# Altium project Version1.PrjPcb
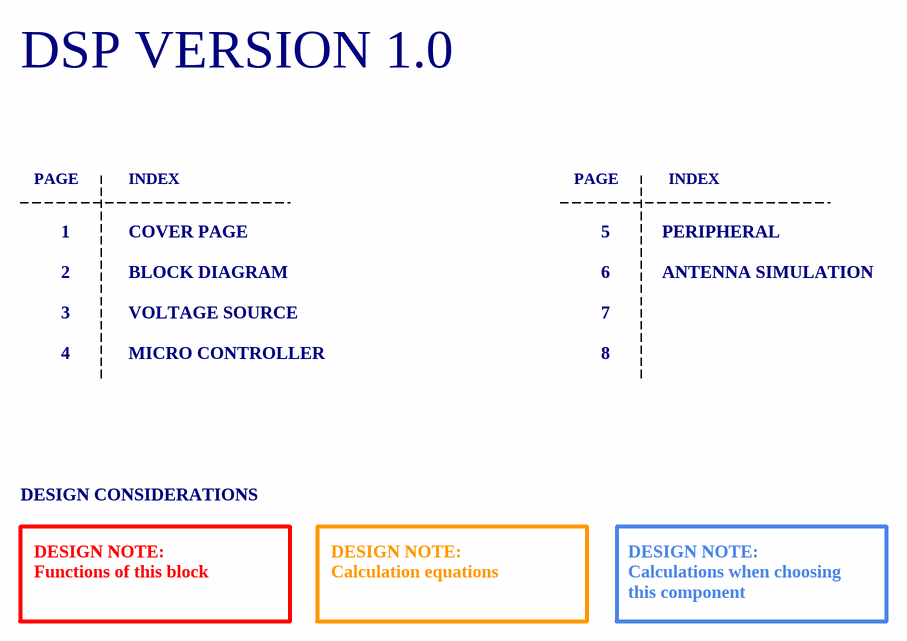
[diagram p0: Cover Page.SchDoc]
6 sheets, 105 parts. Net scope: global (net labels, ports and power ports of the same name join across sheets).
Board file: Version1.PcbDoc
Sheets:
  Cover Page.SchDoc
  Block Diagram.SchDoc
  Voltage Source.SchDoc
  Micro Controller.SchDoc
  Peripheral.SchDoc
  Simulation Antenna.SchDoc

## Sheet Cover Page.SchDoc: Cover Page
size A4; Author: DO DANH LUONG; Revision: 1.0; SheetNumber: 1; SheetTotal: 6; ProjectTitle: DSP_VERSION_1.0

### Notes on the sheet
- DSP VERSION 1.0
- PAGE
- 1
- INDEX
- COVER PAGE
- 5
- PERIPHERAL
- 2
- BLOCK DIAGRAM
- 6
- ANTENNA SIMULATION
- 3
- 4
- VOLTAGE SOURCE
- MICRO CONTROLLER
- 7
- 8
- DESIGN CONSIDERATIONS
- DESIGN NOTE:
  Functions of this block
- DESIGN NOTE:
  Calculation equations
- DESIGN NOTE:
  Calculations when choosing this component
- Author:
- Title:
- Size:
- A4
- Project:
- Approved:
- Revision:
- Modified Date:
- CONFIDENTIAL
- Date:
- SW Version:

## Sheet Block Diagram.SchDoc: Block Diagram
size A4; Author: DO DANH LUONG; Revision: 1.0; SheetNumber: 2; SheetTotal: 6; ProjectTitle: DSP_VERSION_1.0

### Notes on the sheet
- Author:
- Title:
- Size:
- A4
- Project:
- Approved:
- Revision:
- Modified Date:
- CONFIDENTIAL
- Date:
- SW Version:

## Sheet Voltage Source.SchDoc: Voltage Source
size A4; Author: DO DANH LUONG; Revision: 1.0; SheetNumber: 3; SheetTotal: 6
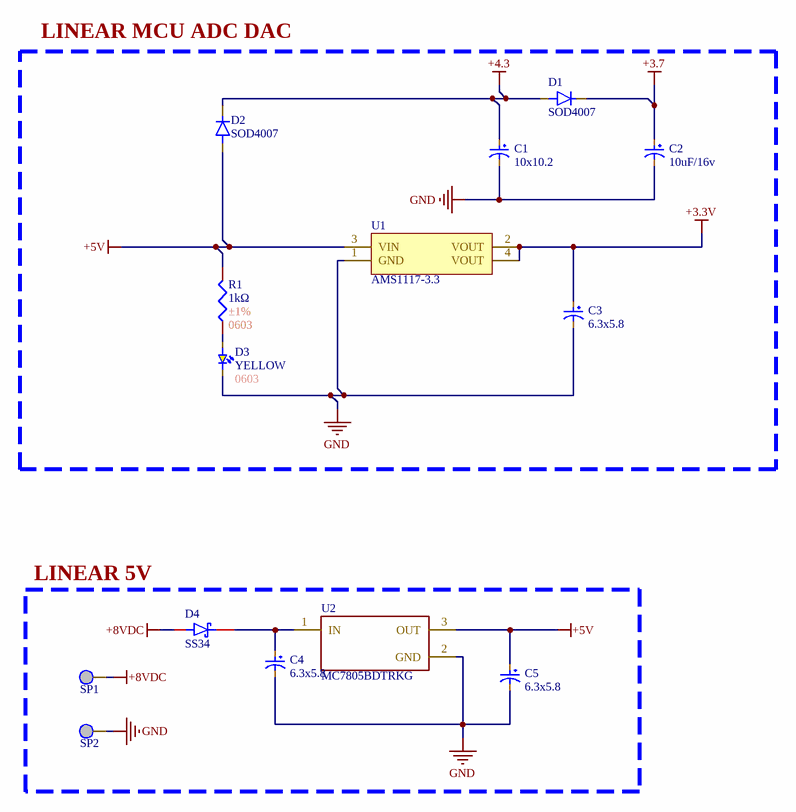
[diagram p1: Voltage Source.SchDoc]

### Parts
C1  10x10.2  [C_10x10.2mm_Aluminum_SMD]
C2  10uF/16v  [C_4.3x5_Aluminum_smd]
C3  6.3x5.8  [C_6.3x5.8mm_Aluminum_SMD]
C4  6.3x5.8  [C_6.3x5.8mm_Aluminum_SMD]
C5  6.3x5.8  [C_6.3x5.8mm_Aluminum_SMD]
D1  SOD4007  [SOD4007]
D2  SOD4007  [SOD4007]
D3  YELLOW  Package: 0603  [LED0603]
D4  SS34  [SS34]
R1  1kΩ  Tolerance: ±1%  Package: 0603  [R0603]
SP1  SP  [SP]  (value not drawn)
SP2  SP  [SP]  (value not drawn)
U1  AMS1117-3.3  [AMS1117-3.3]
U2  MC7805BDTRKG  [7805]

### Blocks framed on the sheet
LINEAR MCU ADC DAC: C1-C3 D1-D3 R1 U1
LINEAR 5V: C4 C5 D4 SP1 SP2 U2

### Nets
+3.3V: C3.1 U1.2(VOUT) U1.4(VOUT)
+3.7: C2.1 D1.1(C)
+4.3: C1.1 D1.2(A) D2.1(C)
+5V: C5.1 D2.2(A) R1.2 U1.3(VIN) U2.3(OUT)
+8VDC: D4.2 SP1.1
GND: C1.2 C2.2 C3.2 C4.2 C5.2 D3.1 SP2.1 U1.1(GND) U2.2(GND)
NetC4_1: C4.1 D4.1 U2.1(IN)
NetD3_2: D3.2 R1.1

### Notes on the sheet
- Author:
- Title:
- Size:
- A4
- Project:
- Approved:
- Revision:
- Modified Date:
- CONFIDENTIAL
- Date:
- SW Version:

### Library data of the parts
C1 = C_10x10.2_Aluminum_SMD: 1000uF 16V ±20% 347mA@120Hz SMD,D10xL10.2mm Aluminum Electrolytic Capacitors RoHS; Manufacturer: ROQANG; Mfr. Part #: RVT1C102M1010; LCSC Part #: C72470; Link: https://www.lcsc.com/product-detail/C72470.html
C2 = C_4.3x5_Aluminum_SMD: 10ÂµF 16V Aluminum Electrolytic Capacitors Radial, Can - SMD 2000 Hrs @ 105Â°C; MP: EEE-HB1C100R; MF: Panasonic Electronic; Price: None; Check_prices: https://www.snapeda.com/parts/EEE-HB1C100R/Panasonic%20Electronic%20Components/view-part/605830/?ref=eda; Value: *; Purchase-URL: https://pricing.snapeda.com/search/part/EEE-HB1C100R/?ref=eda; Package: RADIAL-2 Panasonic; SnapEDA_Link: https://www.snapeda.com/parts/EEE-HB1C100R/Panasonic%20Electronic%20Components/view-part/605830/?ref=snap; Availability: In Stock
C3-C5 = C_6.3x5.8_Aluminum_SMD: 16V 10uF ±20% SMD,D6.3xL5.8mm Aluminum - Polymer Capacitors RoHS; Manufacturer: Honor Elec; Mfr. Part #: HV1C106M0605PZ; LCSC Part #: C5246522; Link: https://www.lcsc.com/product-detail/C5246522.html
D1 D2 = SOD4007: 1A Independent 1kV 1.1V@1A SOD-123FL Diodes - General Purpose ROHS; Manufacturer: MDD(Microdiode Semiconductor); Mfr. Part #: SOD4007; Package: SOD-123FL; LCSC Part #: C18124; Link: https://www.lcsc.com/product-detail/C18124.html?s_z=n_SOD4007; Voltage - DC Reverse(Vr): 1kV; Current - Rectified: 1A
D3 = D0603_YELLOW: 25mcd~40mcd Water Clear -40℃~+85℃ 624nm Red 120° 60mW 0402 LED Indication - Discrete ROHS; Manufacturer: XINGLIGHT; Mfr. Part #: XL-1005UGC; Voltage - Forward(Vf): 3V; LCSC Part #: C965793; Power(Watts): 60mW; Link: https://www.lcsc.com/product-detail/C136765.html?s_z=n_LED%25200402%2520RED; Illumination Color: YELLOW
D4 = SS34: 40V Independent 3A 550mV@3A SMA(DO-214AC) Schottky Diodes ROHS; Manufacturer: MDD(Microdiode Semiconductor); Mfr. Part #: SS34; LCSC Part #: C8678; Package: SMA(DO-214AC); Voltage - DC Reverse(Vr): 40V; Current - Rectified: 3A; Link: https://www.lcsc.com/product-detail/C8678.html?s_z=n_SS34
R1 = R0603_1kΩ_±1%: 62.5mW Thick Film Resistor 50V ±1% ±200ppm/℃ 10Ω 0402 Chip Resistor - Surface Mount ROHS; Manufacturer: YAGEO; Mfr. Part #: RC0402FR-0710RL; LCSC Part #: C138066; Resistance: 1kΩ; Link: https://www.lcsc.com/product-detail/C138066.html?s_z=n_resistor%25200402%252010R
U1 = AMS1117-3.3: 72dB@(120Hz) 1A Fixed 3.3V Positive 16V SOT-223 Voltage Regulators - Linear, Low Drop Out (LDO) Regulators ROHS; Manufacturer: Advanced Monolithic Systems; LCSC Part #: C6186; Link: https://www.lcsc.com/product-detail/C6186.html?s_z=n_ams1117-3.3; Output Current: 1A; Package: SOT-223; Mfr. Part #: AMS1117-3.3
U2 = 7805: 68dB@(120Hz) 1A Fixed 5V Positive 24V TO-252-2(DPAK) Voltage Regulators - Linear, Low Drop Out (LDO) Regulators ROHS; Manufacturer: onsemi; Mfr. Part #: MC7805BDTRKG; LCSC Part #: C110908; Package: TO-252-2(DPAK); Output Current: 1A; Output Voltage: 5V; Voltage - Supply: 24V; Link: https://www.lcsc.com/product-detail/C110908.html?s_z=n_7805

## Sheet Micro Controller.SchDoc: Micro Controller
size A4; Author: DO DANH LUONG; Revision: 1.0; SheetNumber: 4; SheetTotal: 6; ProjectTitle: DSP_VERSION_1.0
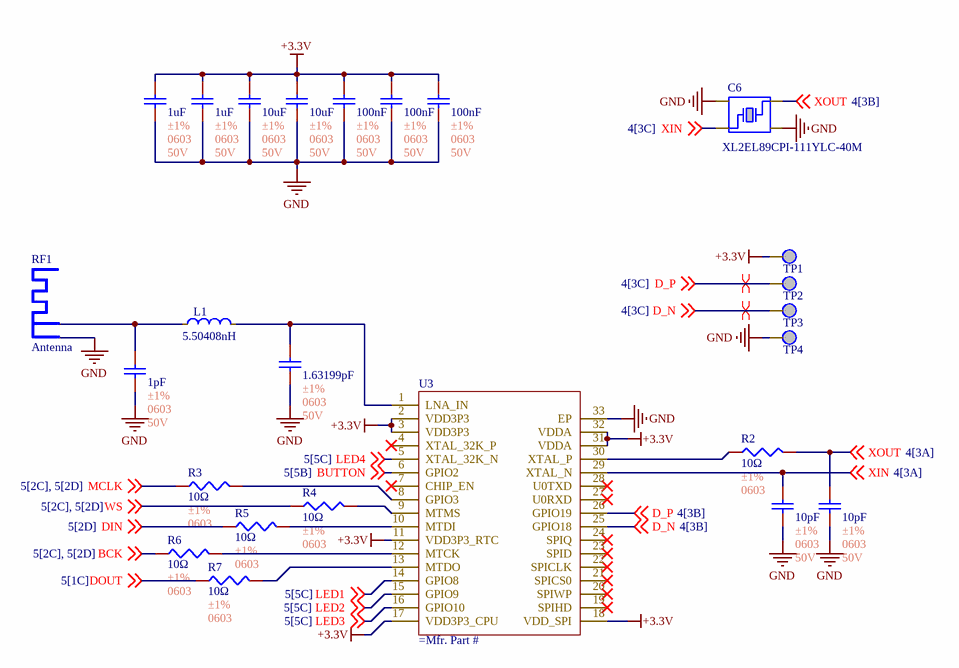
[diagram p2: Micro Controller.SchDoc]

### Parts
C6  XL2EL89CPI-111YLC-40M  [XL2EL89CPI-111YLC-40M]
C7  1uF  Tolerance: ±1%  Package: 0603  Voltage Rating: 50V  [C0603]
C8  1uF  Tolerance: ±1%  Package: 0603  Voltage Rating: 50V  [C0603]
C9  10uF  Tolerance: ±1%  Package: 0603  Voltage Rating: 50V  [C0603]
C10  10uF  Tolerance: ±1%  Package: 0603  Voltage Rating: 50V  [C0603]
C11  100nF  Tolerance: ±1%  Package: 0603  Voltage Rating: 50V  [C0603]
C12  100nF  Tolerance: ±1%  Package: 0603  Voltage Rating: 50V  [C0603]
C13  100nF  Tolerance: ±1%  Package: 0603  Voltage Rating: 50V  [C0603]
C14  1pF  Tolerance: ±1%  Package: 0603  Voltage Rating: 50V  [C0603]
C15  1.63199pF  Tolerance: ±1%  Package: 0603  Voltage Rating: 50V  [C0603]
C16  10pF  Tolerance: ±1%  Package: 0603  Voltage Rating: 50V  [C0603]
C17  10pF  Tolerance: ±1%  Package: 0603  Voltage Rating: 50V  [C0603]
L1  5.50408nH  [0603CT-3N0XGRW]
R2  10Ω  Tolerance: ±1%  Package: 0603  [R0603]
R3  10Ω  Tolerance: ±1%  Package: 0603  [R0603]
R4  10Ω  Tolerance: ±1%  Package: 0603  [R0603]
R5  10Ω  Tolerance: ±1%  Package: 0603  [R0603]
R6  10Ω  Tolerance: ±1%  Package: 0603  [R0603]
R7  10Ω  Tolerance: ±1%  Package: 0603  [R0603]
RF1  Antenna  [2.4GHZ-50OHMS_v1.1]
TP1  TP  [TP]  (value not drawn)
TP2  TP  [TP]  (value not drawn)
TP3  TP  [TP]  (value not drawn)
TP4  TP  [TP]  (value not drawn)
U3  (no value)  [ESP32-C3]

### Nets
+3.3V: C7.1 C8.1 C9.1 C10.1 C11.1 C12.1 C13.1 TP1.1 U3.2(VDD3P3) U3.3(VDD3P3) U3.11(VDD3P3_RTC) U3.17(VDD3P3_CPU) U3.18(VDD_SPI) U3.31(VDDA) U3.32(VDDA)
GND: C6.2 C6.4 C7.2 C8.2 C9.2 C10.2 C11.2 C12.2 C13.2 C14.2 C15.2 C16.2 C17.2 RF1.2 TP4.1 U3.33(EP)
BCK: R6.1 ; off-sheet BCK
BUTTON: U3.6(GPIO2) ; off-sheet BUTTON
D_N: TP3.1 U3.25(GPIO18) ; off-sheet D_N
D_P: TP2.1 U3.26(GPIO19) ; off-sheet D_P
DIN: R5.1 ; off-sheet DIN
DOUT: R7.1 ; off-sheet DOUT
LED1: U3.14(GPIO8) ; off-sheet LED1
LED2: U3.15(GPIO9) ; off-sheet LED2
LED3: U3.16(GPIO10) ; off-sheet LED3
LED4: U3.5(XTAL_32K_N) ; off-sheet LED4
MCLK: R3.1 ; off-sheet MCLK
WS: R4.1 ; off-sheet WS
XIN: C6.1 C16.1 U3.29(XTAL_N) ; off-sheet XIN
XOUT: C6.3 C17.1 R2.2 ; off-sheet XOUT
NetC14_1: C14.1 L1.1 RF1.1
NetC15_1: C15.1 L1.2 U3.1(LNA_IN)
NetR2_1: R2.1 U3.30(XTAL_P)
NetR3_2: R3.2 U3.8(GPIO3)
NetR4_2: R4.2 U3.9(MTMS)
NetR5_2: R5.2 U3.10(MTDI)
NetR6_2: R6.2 U3.12(MTCK)
NetR7_2: R7.2 U3.13(MTDO)

Not connected (* = marked no-connect by the designer): U3 4(XTAL_32K_P)* 7(CHIP_EN)* 19(SPIHD)* 20(SPIWP)* 21(SPICS0)* 22(SPICLK)* 23(SPID)* 24(SPIQ)* 27(U0RXD)* 28(U0TXD)*

### Layout directives
differential pair: D_N, D_P

### Notes on the sheet
- Author:
- Title:
- Size:
- A4
- Project:
- Approved:
- Revision:
- Modified Date:
- CONFIDENTIAL
- Date:
- SW Version:

### Library data of the parts
C6 = XL2EL89CPI-111YLC-40M: Crystal Oscillator 15pF SMD3225-4P Crystals RoHS; Manufacturer: YXC Crystal Oscillators; Mfr. Part #: XL2EL89CPI-111YLC-40M; LCSC Part #: C5444549; Package: SMD3225-4P; Link: https://www.lcsc.com/product-detail/C5444549.html?s_z=n_oscillator; Key Attributes: Crystal Oscillator 15pF SMD3225-4P Crystals RoHS
C7 C8 = C0603_1uF_±1%: 50V 10pF NP0 ±1% 0402 Multilayer Ceramic Capacitors MLCC - SMD/SMT ROHS; Manufacturer: YAGEO; Mfr. Part #: CC0402FRNPO9BN100; LCSC Part #: C513681; Link: https://www.lcsc.com/product-detail/C513681.html?s_z=n_capital%2520yageo%252010pF%25200402; Capacitance: 1uF
C9 C10 = C0603_10uF_±1%: 50V 10pF NP0 ±1% 0402 Multilayer Ceramic Capacitors MLCC - SMD/SMT ROHS; Manufacturer: YAGEO; Mfr. Part #: CC0402FRNPO9BN100; LCSC Part #: C513681; Link: https://www.lcsc.com/product-detail/C513681.html?s_z=n_capital%2520yageo%252010pF%25200402; Capacitance: 10uF
C11-C13 = C0603_100nF_±1%: 50V 10pF NP0 ±1% 0402 Multilayer Ceramic Capacitors MLCC - SMD/SMT ROHS; Manufacturer: YAGEO; Mfr. Part #: CC0402FRNPO9BN100; LCSC Part #: C513681; Link: https://www.lcsc.com/product-detail/C513681.html?s_z=n_capital%2520yageo%252010pF%25200402; Capacitance: 100nF
C14-C17 = C0603_10pF_±1%: 50V 10pF NP0 ±1% 0402 Multilayer Ceramic Capacitors MLCC - SMD/SMT ROHS; Manufacturer: YAGEO; Mfr. Part #: CC0402FRNPO9BN100; LCSC Part #: C513681; Link: https://www.lcsc.com/product-detail/C513681.html?s_z=n_capital%2520yageo%252010pF%25200402; Capacitance: 10pF
L1 = L_3nH_3.6A_0603: 1.6A 3nH 39mΩ Wire-wound chip inductor ±2% 0603 Fixed Inductors RoHS; Manufacturer: Coilcraft; Mfr. Part #: 0603CT-3N0XGRW; LCSC Part #: C41050064; Package: 0603; Key Attributes: 1.6A 3nH 39mΩ Wire-wound chip inductor ±2% 0603 Fixed Inductors RoHS; Link: https://www.lcsc.com/product-detail/C41050064.html?s_z=n_inductor%25203nH%25200603
R2-R7 = R0603_10Ω_±1%: 62.5mW Thick Film Resistor 50V ±1% ±200ppm/℃ 10Ω 0402 Chip Resistor - Surface Mount ROHS; Manufacturer: YAGEO; Mfr. Part #: RC0402FR-0710RL; LCSC Part #: C138066; Resistance: 10Ω; Link: https://www.lcsc.com/product-detail/C138066.html?s_z=n_resistor%25200402%252010R
U3 = ESP32-C3: Others 160MHz QFN-32-EP(5x5) RF Transceiver Modules and Modems RoHS; Manufacturer: ESPRESSIF; LCSC Part #: C2838500; Package: QFN-32-EP(5x5); Link: https://www.lcsc.com/product-detail/C2838500.html?s_z=n_ESP32%2520C3

## Sheet Peripheral.SchDoc: Peripheral
size A3; Author: DO DANH LUONG; Revision: 1.0; SheetNumber: 5; SheetTotal: 6; ProjectTitle: DSP_VERSION_1.0
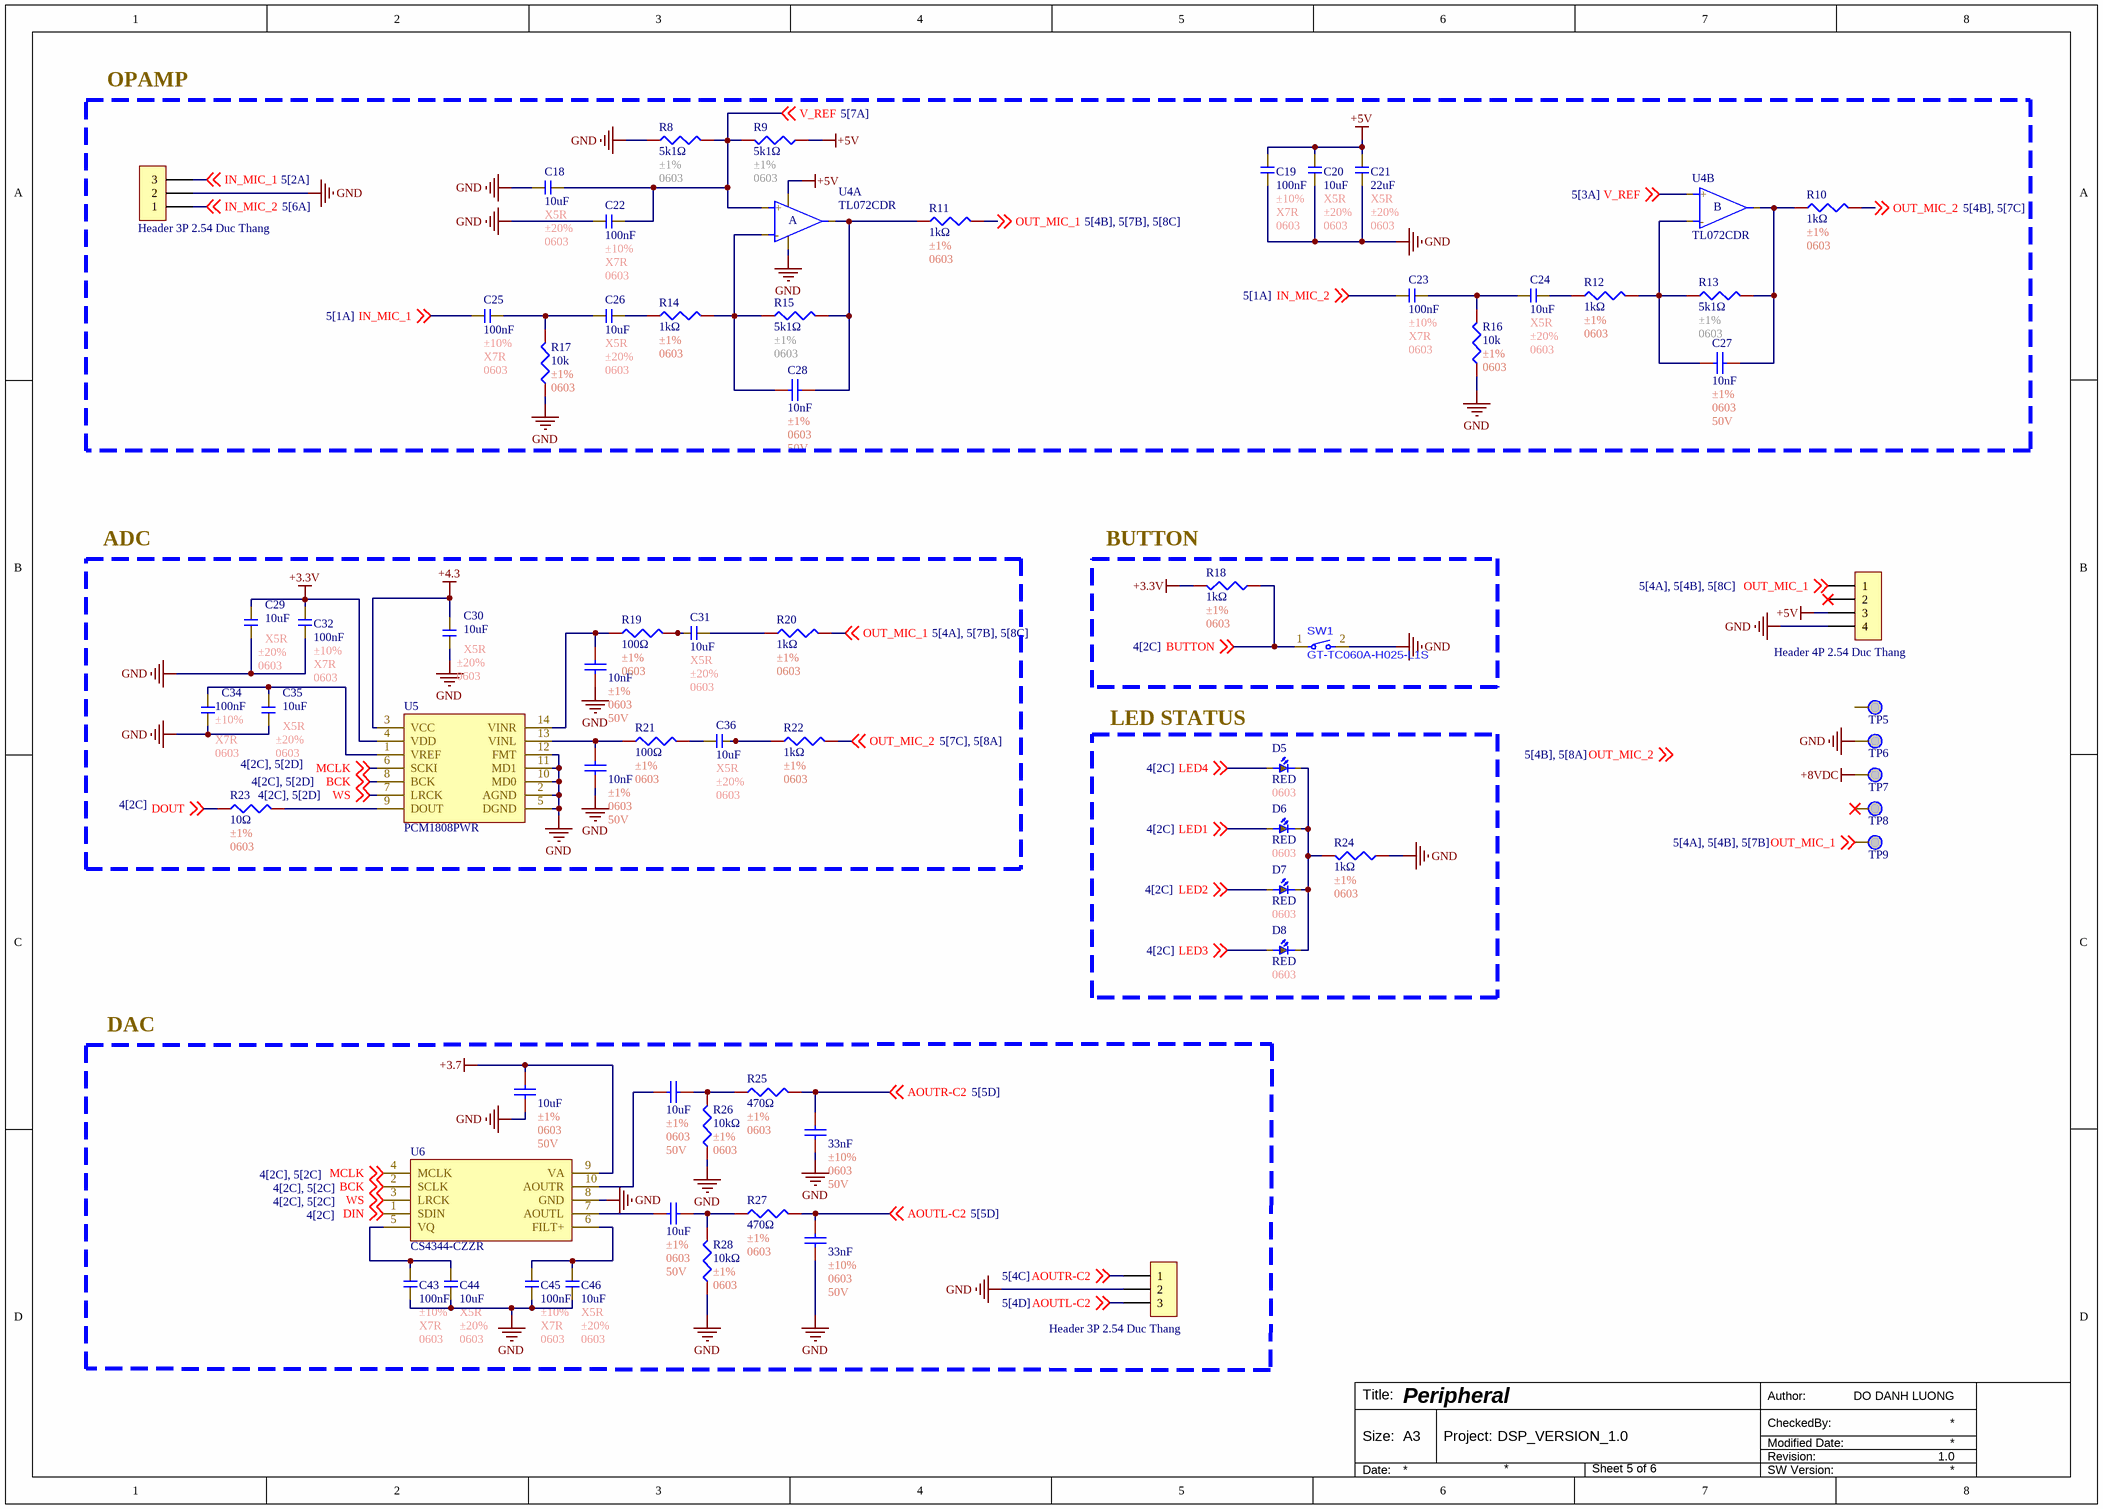
[diagram p3: Peripheral.SchDoc]

### Parts
C18  10uF  Temperature Coefficient: X5R  Tolerance: ±20%  Package: 0603  [C0603]
C19  100nF  Tolerance: ±10%  Temperature Coefficient: X7R  Package: 0603  [C0603]
C20  10uF  Temperature Coefficient: X5R  Tolerance: ±20%  Package: 0603  [C0603]
C21  22uF  Temperature Coefficient: X5R  Tolerance: ±20%  Package: 0603  [C0603]
C22  100nF  Tolerance: ±10%  Temperature Coefficient: X7R  Package: 0603  [C0603]
C23  100nF  Tolerance: ±10%  Temperature Coefficient: X7R  Package: 0603  [C0603]
C24  10uF  Temperature Coefficient: X5R  Tolerance: ±20%  Package: 0603  [C0603]
C25  100nF  Tolerance: ±10%  Temperature Coefficient: X7R  Package: 0603  [C0603]
C26  10uF  Temperature Coefficient: X5R  Tolerance: ±20%  Package: 0603  [C0603]
C27  10nF  Tolerance: ±1%  Package: 0603  Voltage Rating: 50V  [C0603]
C28  10nF  Tolerance: ±1%  Package: 0603  Voltage Rating: 50V  [C0603]
C29  10uF  Temperature Coefficient: X5R  Tolerance: ±20%  Package: 0603  [C0603]
C30  10uF  Temperature Coefficient: X5R  Tolerance: ±20%  Package: 0603  [C0603]
C31  10uF  Temperature Coefficient: X5R  Tolerance: ±20%  Package: 0603  [C0603]
C32  100nF  Tolerance: ±10%  Temperature Coefficient: X7R  Package: 0603  [C0603]
C33  10nF  Tolerance: ±1%  Package: 0603  Voltage Rating: 50V  [C0603]
C34  100nF  Tolerance: ±10%  Temperature Coefficient: X7R  Package: 0603  [C0603]
C35  10uF  Temperature Coefficient: X5R  Tolerance: ±20%  Package: 0603  [C0603]
C36  10uF  Temperature Coefficient: X5R  Tolerance: ±20%  Package: 0603  [C0603]
C37  10nF  Tolerance: ±1%  Package: 0603  Voltage Rating: 50V  [C0603]
C38  10uF  Tolerance: ±1%  Package: 0603  Voltage Rating: 50V  [C0603]
C39  10uF  Tolerance: ±1%  Package: 0603  Voltage Rating: 50V  [C0603]
C40  33nF  Tolerance: ±10%  Package: 0603  Voltage Rating: 50V  [C0603]
C41  10uF  Tolerance: ±1%  Package: 0603  Voltage Rating: 50V  [C0603]
C42  33nF  Tolerance: ±10%  Package: 0603  Voltage Rating: 50V  [C0603]
C43  100nF  Tolerance: ±10%  Temperature Coefficient: X7R  Package: 0603  [C0603]
C44  10uF  Temperature Coefficient: X5R  Tolerance: ±20%  Package: 0603  [C0603]
C45  100nF  Tolerance: ±10%  Temperature Coefficient: X7R  Package: 0603  [C0603]
C46  10uF  Temperature Coefficient: X5R  Tolerance: ±20%  Package: 0603  [C0603]
D5  RED  Package: 0603  [LED0603]
D6  RED  Package: 0603  [LED0603]
D7  RED  Package: 0603  [LED0603]
D8  RED  Package: 0603  [LED0603]
H1  Header 3P 2.54 Duc Thang  [XH2.54M-3]
H2  Header 4P 2.54 Duc Thang  [XH2.54M-4]
H3  Header 3P 2.54 Duc Thang  [XH2.54M-3]
R8  5k1Ω  Tolerance: ±1%  Package: 0603  [R0603]
R9  5k1Ω  Tolerance: ±1%  Package: 0603  [R0603]
R10  1kΩ  Tolerance: ±1%  Package: 0603  [R0603]
R11  1kΩ  Tolerance: ±1%  Package: 0603  [R0603]
R12  1kΩ  Tolerance: ±1%  Package: 0603  [R0603]
R13  5k1Ω  Tolerance: ±1%  Package: 0603  [R0603]
R14  1kΩ  Tolerance: ±1%  Package: 0603  [R0603]
R15  5k1Ω  Tolerance: ±1%  Package: 0603  [R0603]
R16  10k  Tolerance: ±1%  Package: 0603  [R0603]
R17  10k  Tolerance: ±1%  Package: 0603  [R0603]
R18  1kΩ  Tolerance: ±1%  Package: 0603  [R0603]
R19  100Ω  Tolerance: ±1%  Package: 0603  [R0603]
R20  1kΩ  Tolerance: ±1%  Package: 0603  [R0603]
R21  100Ω  Tolerance: ±1%  Package: 0603  [R0603]
R22  1kΩ  Tolerance: ±1%  Package: 0603  [R0603]
R23  10Ω  Tolerance: ±1%  Package: 0603  [R0603]
R24  1kΩ  Tolerance: ±1%  Package: 0603  [R0603]
R25  470Ω  Tolerance: ±1%  Package: 0603  [R0603]
R26  10kΩ  Tolerance: ±1%  Package: 0603  [R0603]
R27  470Ω  Tolerance: ±1%  Package: 0603  [R0603]
R28  10kΩ  Tolerance: ±1%  Package: 0603  [R0603]
SW1  GT-TC060A-H025-L1S  [GT-TC060A-H025-L1S]
TP5  TP  [TP]  (value not drawn)
TP6  TP  [TP]  (value not drawn)
TP7  TP  [TP]  (value not drawn)
TP8  TP  [TP]  (value not drawn)
TP9  TP  [TP]  (value not drawn)
U4  TL072CDR  [TL072CDR]  (parts A,B of 2)
U5  PCM1808PWR  [PCM1808PWR]
U6  CS4344-CZZR  [CS4344-CZZR]

### Blocks framed on the sheet
OPAMP: C18-C28 H1 R8-R17 U4
ADC: C29-C37 R19-R23 U5
BUTTON: R18 SW1
LED STATUS: D5-D8 R24
DAC: C38-C46 H3 R25-R28 U6

### Nets
+3.3V: C29.2 C32.2 R18.2 U5.4(VDD)
+3.7: C39.1 U6.9(VA)
+4.3: C30.2 U5.3(VCC)
+5V: C19.2 C20.2 C21.2 H2.3 R9.1 U4.8
+8VDC: TP7.1
GND: C18.2 C19.1 C20.1 C21.1 C22.2 C29.1 C30.1 C32.1 C33.2 C34.1 C35.1 C37.2 C39.2 C40.2 C42.2 C43.1 C44.1 C45.1 C46.1 H1.2 H2.4 H3.2 R8.1 R16.1 R17.1 R24.1 R26.1 R28.1 SW1.2 TP6.1 U4.4(GND) U5.2(AGND) U5.5(DGND) U5.10(MD0) U5.11(MD1) U5.12(FMT) U6.8(GND)
AOUTL-C2: C42.1 H3.3 R27.2 ; off-sheet AOUTL-C2
AOUTR-C2: C40.1 H3.1 R25.2 ; off-sheet AOUTR-C2
BCK: U5.8(BCK) U6.2(SCLK) ; off-sheet BCK
BUTTON: R18.1 SW1.1 ; off-sheet BUTTON
DIN: U6.1(SDIN) ; off-sheet DIN
DOUT: R23.1 ; off-sheet DOUT
IN_MIC_1: C25.2 H1.3 ; off-sheet IN_MIC_1
IN_MIC_2: C23.2 H1.1 ; off-sheet IN_MIC_2
LED1: D6.2 ; off-sheet LED1
LED2: D7.2 ; off-sheet LED2
LED3: D8.2 ; off-sheet LED3
LED4: D5.2 ; off-sheet LED4
MCLK: U5.6(SCKI) U6.4(MCLK) ; off-sheet MCLK
OUT_MIC_1: H2.1 R11.2 R20.2 TP9.1 ; off-sheet OUT_MIC_1
OUT_MIC_2: R10.2 R22.2 ; off-sheet OUT_MIC_2
V_REF: C18.1 C22.1 R8.2 R9.2 U4.3(+) U4.5(+) ; off-sheet V_REF
WS: U5.7(LRCK) U6.3(LRCK) ; off-sheet WS
NetC23_1: C23.1 C24.2 R16.2
NetC24_1: C24.1 R12.1
NetC25_1: C25.1 C26.2 R17.2
NetC26_1: C26.1 R14.1
NetC27_1: C27.1 R12.2 R13.1 U4.6(-)
NetC27_2: C27.2 R10.1 R13.2 U4.7(out)
NetC28_1: C28.1 R14.2 R15.1 U4.2(-)
NetC28_2: C28.2 R11.1 R15.2 U4.1(out)
NetC31_1: C31.1 R20.1
NetC31_2: C31.2 R19.2
NetC33_1: C33.1 R19.1 U5.14(VINR)
NetC34_2: C34.2 C35.2 U5.1(VREF)
NetC36_1: C36.1 R22.1
NetC36_2: C36.2 R21.2
NetC37_1: C37.1 R21.1 U5.13(VINL)
NetC38_1: C38.1 R25.1 R26.2
NetC38_2: C38.2 U6.10(AOUTR)
NetC41_1: C41.1 R27.1 R28.2
NetC41_2: C41.2 U6.7(AOUTL)
NetC43_2: C43.2 C44.2 U6.5(VQ)
NetC45_2: C45.2 C46.2 U6.6(FILT+)
NetD5_1: D5.1 D6.1 D7.1 D8.1 R24.2
NetR23_2: R23.2 U5.9(DOUT)

Not connected (* = marked no-connect by the designer): H2 2*; TP5 1; TP8 1*

### Notes on the sheet
- Labels drawn without touching a wire or pin: OUT_MIC_2
- Author:
- Title:
- Size:
- A3
- Project:
- Revision:
- Modified Date:
- CheckedBy:
- Date:
- SW Version:
- (in symbol TL072CDR, part A) A
- (in symbol TL072CDR, part B) B

### Library data of the parts
C18 C20 C24 C26 C29-C31 C35 C36 C44 C46 = C0603_10uF_±10%_X7R: 25V 10uF X5R ±20% 0603 Multilayer Ceramic Capacitors MLCC - SMD/SMT ROHS; Manufacturer: YAGEO; Mfr. Part #: CC0603MRX5R8BB106; LCSC Part #: C596327; Capacitance: 10uF; Link: https://www.lcsc.com/product-detail/C596327.html?s_z=n_capital%25200603%252010uF%2520yageo
C19 C22 C23 C25 C32 C34 C43 C45 = C0603_100nF_±10%_X7R: 50V 100nF X7R ±10% 0603 Multilayer Ceramic Capacitors MLCC - SMD/SMT ROHS; Manufacturer: YAGEO; Mfr. Part #: CC0603KRX7R9BB104; LCSC Part #: C14663; Capacitance: 100nF; Link: https://www.lcsc.com/product-detail/C14663.html?s_z=n_capital%25200603%2520100nf
C21 = C0603_22uF_±20%_X5R: 6.3V 22uF X5R ±20% 0603 Multilayer Ceramic Capacitors MLCC - SMD/SMT ROHS; Manufacturer: YAGEO; Mfr. Part #: CC0603MRX5R5BB226; LCSC Part #: C109448; ComponentLink1Description: New link; ComponentLink1URL: *; Capacitance: 22uF; Link: https://www.lcsc.com/product-detail/C109448.html?s_z=n_capital%25200603%252022uf%2520yageo
C27 C28 C33 C37 = C0603_10nF_±1%: 50V 10pF NP0 ±1% 0402 Multilayer Ceramic Capacitors MLCC - SMD/SMT ROHS; Manufacturer: YAGEO; Mfr. Part #: CC0402FRNPO9BN100; LCSC Part #: C513681; Link: https://www.lcsc.com/product-detail/C513681.html?s_z=n_capital%2520yageo%252010pF%25200402; Capacitance: 10nF
C38 C39 C41 = C0603_10uF_±1%: as C9 on sheet Micro Controller; LCSC Part #: C513681; Link: https://www.lcsc.com/product-detail/C513681.html?s_z=n_capital%2520yageo%252010pF%25200402; Capacitance: 10uF
C40 C42 = C0603_33nF_±10%: 100mW Thick Film Resistor 75V ±100ppm/℃ ±1% 470Ω 0603 Chip Resistor - Surface Mount ROHS; Manufacturer: YAGEO; Mfr. Part #: CC0603KRX7R9BB333; Temperature Coefficient: X7R; LCSC Part #: C106856; Link: https://www.lcsc.com/product-detail/C106856.html?s_z=n_capital%2520yageo%25200603%252033nF; Capacitance: 33nF
D5-D8 = D0603_RED: 25mcd~40mcd Water Clear -40℃~+85℃ 624nm Red 120° 60mW 0402 LED Indication - Discrete ROHS; Manufacturer: XINGLIGHT; Mfr. Part #: XL-1005UGC; Voltage - Forward(Vf): 3V; LCSC Part #: C965793; Power(Watts): 60mW; Link: https://www.lcsc.com/product-detail/C136765.html?s_z=n_LED%25200402%2520RED; Illumination Color: RED
H1 H3 = Header 3P 2.54 Duc Thang: Cắm; Ten_Linh_Kien: Header 3P XH2.54-3P Đực Thẳng; Don_Vi: Con; Ma_Hang: MH001292; Chung_Loai: Cắm
H2 = Header 4P 2.54 Duc Thang: Cắm; Ten_Linh_Kien: Header 4P XH2.54-4P Đực Thẳng; Don_Vi: Con; Ma_Hang: MH001285; Chung_Loai: Cắm
R8 R9 R13 R15 = R0603_5k1Ω_±1%: 100mW Thick Film Resistor 75V ±100ppm/℃ ±1% 5.1kΩ 0603 Chip Resistor - Surface Mount ROHS; Manufacturer: FOJAN; Mfr. Part #: FRC0603F5101TS; Key Attributes: RES 5.1kΩ ±1% 100mW 0603; LCSC Part #: C2907044; Link: https://www.lcsc.com/product-detail/C2907044.html?s_z=n_5k1%25200603; Resistance: 5k1Ω
R10-R12 R14 R18 R20 R22 R24 = R0603_1kΩ_±1%: as R1 on sheet Voltage Source; LCSC Part #: C138066; Resistance: 1kΩ; Link: https://www.lcsc.com/product-detail/C138066.html?s_z=n_resistor%25200402%252010R
R16 R17 = R0603_1kΩ_±1%: 62.5mW Thick Film Resistor 50V ±1% ±200ppm/℃ 10Ω 0402 Chip Resistor - Surface Mount ROHS; Manufacturer: YAGEO; Mfr. Part #: RC0402FR-0710RL; Resistance: 1kΩ; LCSC Part #: C138066; Link: https://www.lcsc.com/product-detail/C138066.html?s_z=n_resistor%25200402%252010R
R19 R21 = R0603_100Ω_±1%: 62.5mW Thick Film Resistor 50V ±1% ±200ppm/℃ 10Ω 0402 Chip Resistor - Surface Mount ROHS; Manufacturer: YAGEO; Mfr. Part #: RC0402FR-0710RL; LCSC Part #: C138066; Resistance: 100Ω; Link: https://www.lcsc.com/product-detail/C138066.html?s_z=n_resistor%25200402%252010R
R23 = R0603_10Ω_±1%: as R2 on sheet Micro Controller; LCSC Part #: C138066; Resistance: 10Ω; Link: https://www.lcsc.com/product-detail/C138066.html?s_z=n_resistor%25200402%252010R
R25 R27 = R0603_470Ω_±1%_1: 62.5mW Thick Film Resistor 50V ±1% ±200ppm/℃ 10Ω 0402 Chip Resistor - Surface Mount ROHS; Manufacturer: YAGEO; Mfr. Part #: RC0603FR-07470RL; Key Attributes: RES 470Ω ±1% 100mW 0603; LCSC Part #: C114669; Resistance: 470Ω; Link: https://www.lcsc.com/product-detail/C114669.html?s_z=n_resistor%2520470%25CE%25A9%25200603%2520yageo
R26 R28 = R0603_10kΩ_±1%: 62.5mW Thick Film Resistor 50V ±1% ±200ppm/℃ 10Ω 0402 Chip Resistor - Surface Mount ROHS; Manufacturer: YAGEO; Mfr. Part #: RC0402FR-0710RL; LCSC Part #: C138066; Resistance: 10kΩ; Link: https://www.lcsc.com/product-detail/C138066.html?s_z=n_resistor%25200402%252010R
SW1 = GT-TC060A-H025-L1S: Tactile Switch SPST 160gf 2.5mm SMD (SMT) Tab 6.05mm x 3.5mm Surface Mount; Manufacturer: G-Switch; Key Attributes: SWITCH TACTILE SPST 160gf SMD; Mfr. Part #: GT-TC060A-H025-L1S; LCSC Part #: C7450623; Package: SMD,6x3mm; Link: https://www.lcsc.com/product-detail/C7450623.html?s_z=n_button
U4 = TL072CDR: 3mV 65pA 3MHz 13V/us 2 SOIC-8 FET Input Amplifiers ROHS; Manufacturer: TI; Noise density(eN): 18nV/√Hz@1kHz; Dual Supply: -15V~15V; Number of Channels: 2; LCSC Part #: C67473; Package: SOIC-8; Gain Bandwidth Product: 3MHz; Link: https://www.lcsc.com/product-detail/C67473.html?s_z=n_TL072CDR; Mfr. Part #: TL072CDR
U5 = PCM1808PWR: 4.5V~5.5V 24 I2S TSSOP-14 ADCs/DACs - Special Purpose ROHS; Manufacturer: TI; Key Attributes: Single-ended analog input 24-bit 96kHz stereo A/D converter; Number of Channels: 2; Mfr. Part #: PCM1808PWR; LCSC Part #: C55513; Package: TSSOP-14; Voltage - Supply: 4.5V~5.5V; Interface: I2S; Link: https://www.lcsc.com/product-detail/C55513.html?s_z=n_pcm1808
U6 = CS4344-CZZR: 250ms I2S 3.3V~5V 24 TSSOP-10-3mm Digital to Analog Converters (DAC) ROHS; Manufacturer: Cirrus Logic; Key Attributes: 10-Pin, 24-Bit, 192 kHz Stereo D/A Converter; Number of Channels: 2; Mfr. Part #: CS4344-CZZR; LCSC Part #: C8952; Package: TSSOP-10-3mm; Link: https://www.lcsc.com/product-detail/C8952.html?s_z=n_cs4344; Voltage - Supply: 3.3V~5V; Interface: I2S

## Sheet Simulation Antenna.SchDoc: Antenna Simulation
size A3; Author: DO DANH LUONG; Revision: 1.0; SheetNumber: 6; SheetTotal: 6; ProjectTitle: DSP_VERSION_1.0

### Notes on the sheet
- Author:
- Title:
- Size:
- A3
- Project:
- Revision:
- Modified Date:
- CheckedBy:
- Date:
- SW Version:

## Nets that join several sheets
+3.3V: Voltage Source (C3.1 U1.2 U1.4), Micro Controller (15 pins), Peripheral (C29.2 C32.2 R18.2 U5.4)
+3.7: Voltage Source (C2.1 D1.1), Peripheral (C39.1 U6.9)
+4.3: Voltage Source (C1.1 D1.2 D2.1), Peripheral (C30.2 U5.3)
+5V: Voltage Source (5 pins), Peripheral (6 pins)
+8VDC: Voltage Source (D4.2 SP1.1), Peripheral (TP7.1)
GND: Voltage Source (9 pins), Micro Controller (16 pins), Peripheral (37 pins)
BCK: Micro Controller (R6.1), Peripheral (U5.8 U6.2)
BUTTON: Micro Controller (U3.6), Peripheral (R18.1 SW1.1)
DIN: Micro Controller (R5.1), Peripheral (U6.1)
DOUT: Micro Controller (R7.1), Peripheral (R23.1)
LED1: Micro Controller (U3.14), Peripheral (D6.2)
LED2: Micro Controller (U3.15), Peripheral (D7.2)
LED3: Micro Controller (U3.16), Peripheral (D8.2)
LED4: Micro Controller (U3.5), Peripheral (D5.2)
MCLK: Micro Controller (R3.1), Peripheral (U5.6 U6.4)
WS: Micro Controller (R4.1), Peripheral (U5.7 U6.3)